# Altium schematic sheet Power_Management.SchDoc
size A3; SheetNumber: 2; SheetTotal: 5
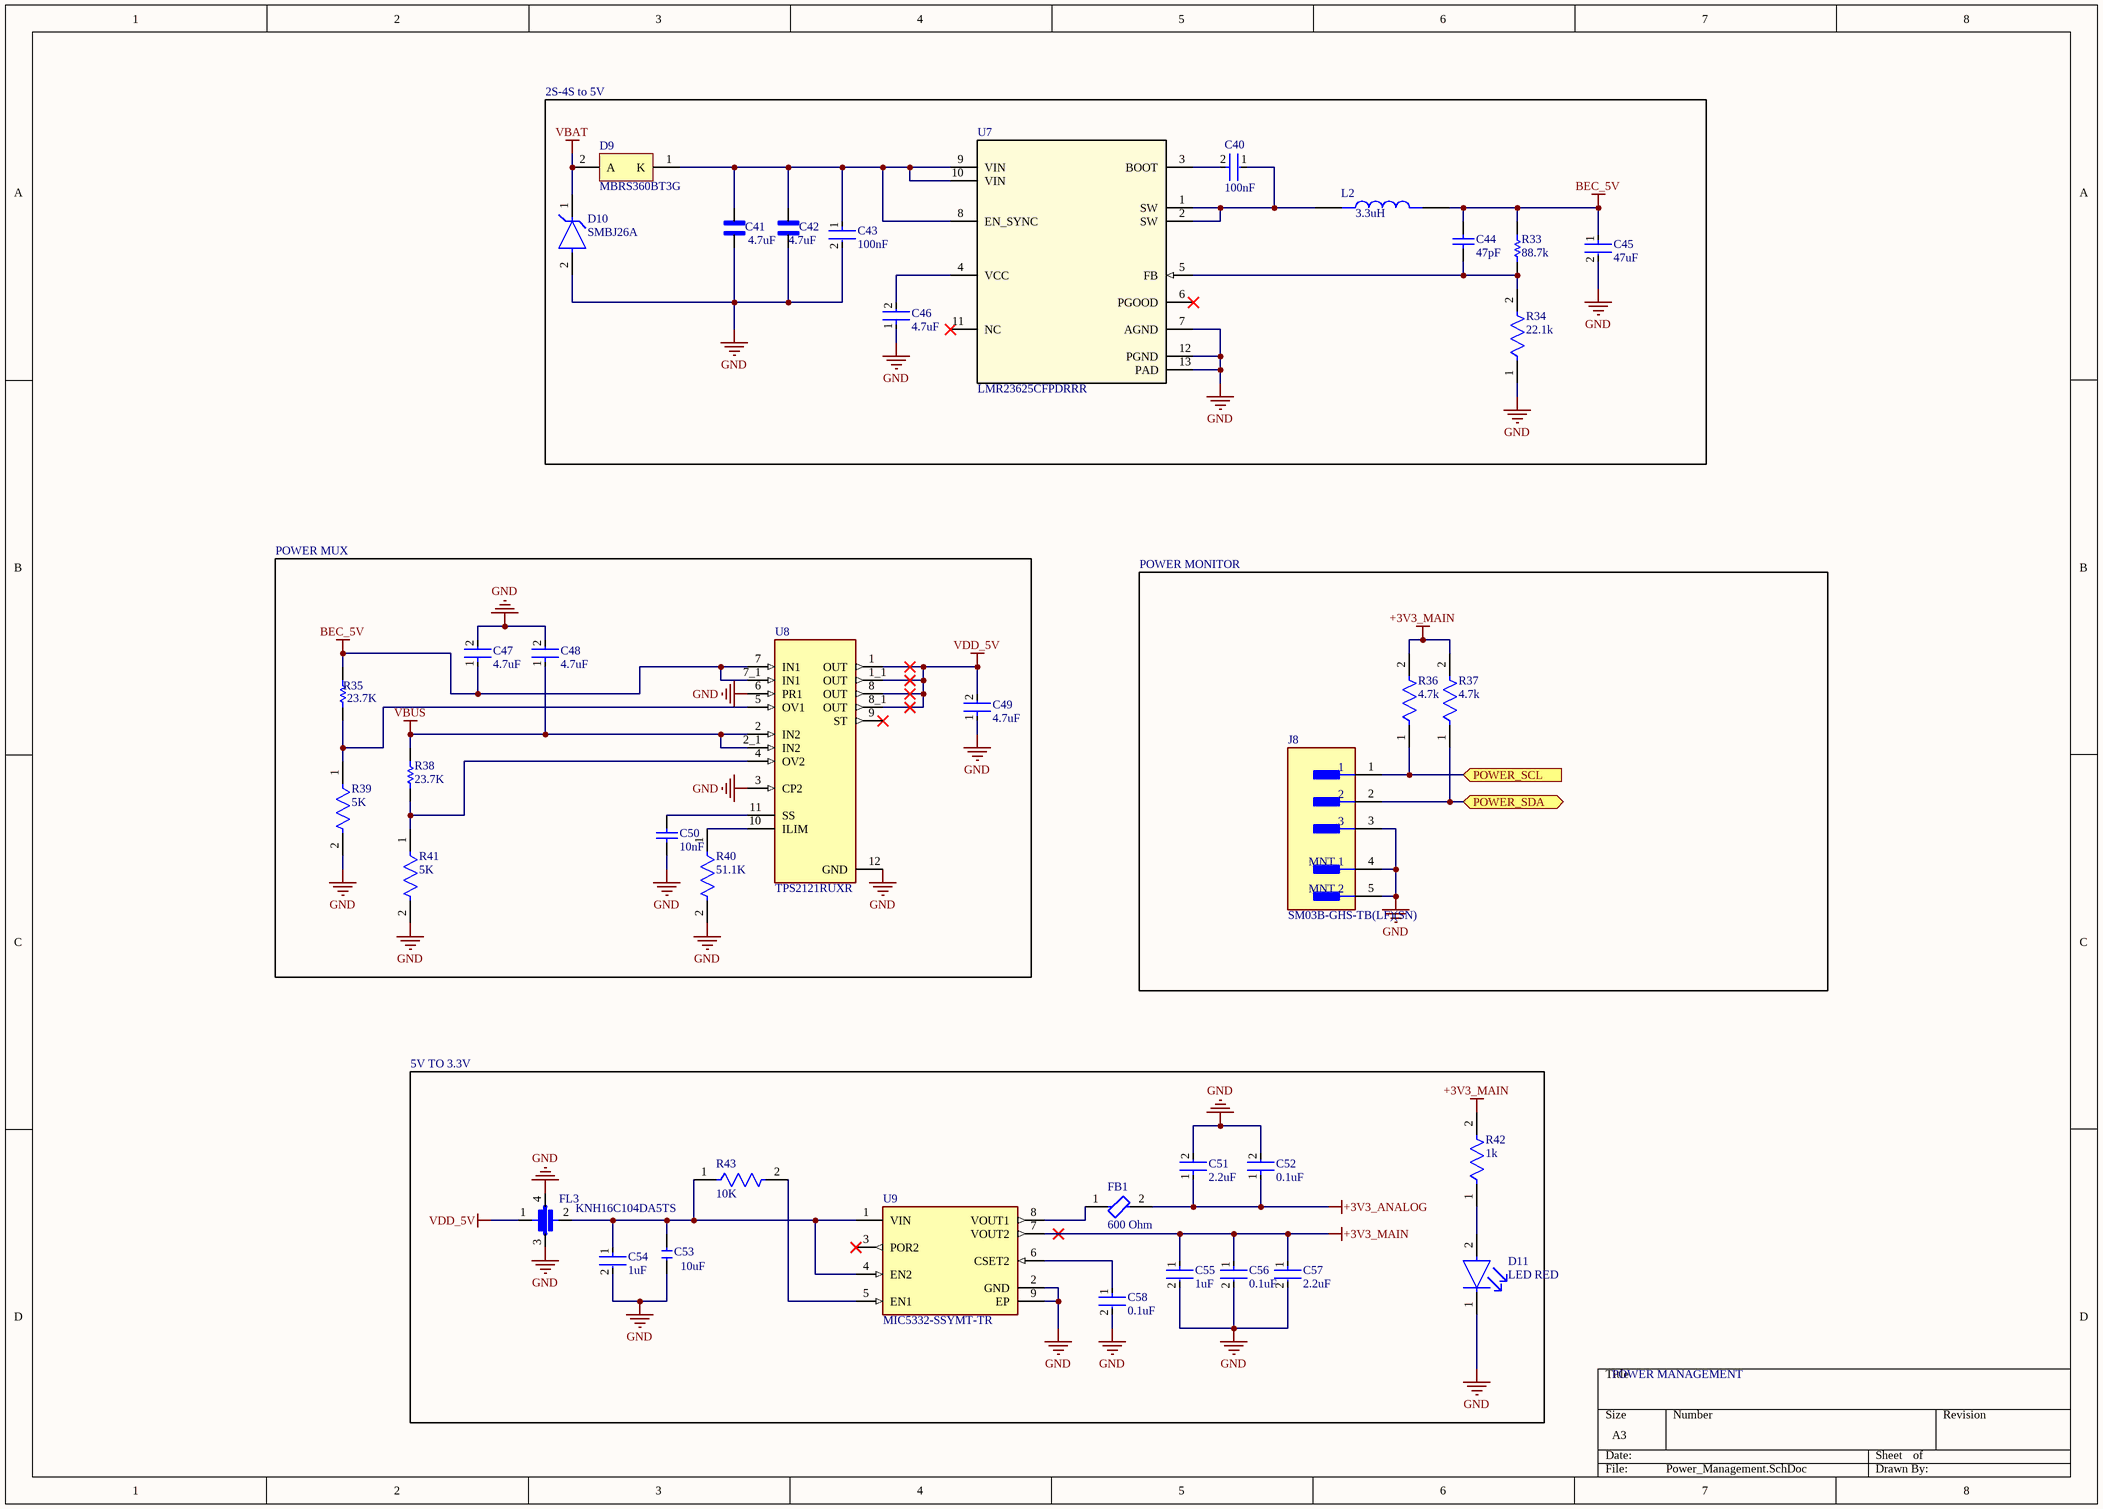
[diagram p0: Power_Management.SchDoc]

## Parts
C40  100nF  [FP-GRM15-MFG]
C41  MSASU32MSB7475MPNA01  [CAPC3225X270N]  (value not drawn)
C42  MSASU32MSB7475MPNA01  [CAPC3225X270N]  (value not drawn)
C43  100nF  [FP-CS0402-CA-MFG]
C44  47pF  [CAPC1005X55X25NL05T10]
C45  47uF  [FP-GRM31C-0_2-e0_3_0_8-IPC_A]
C46  4.7uF  [FP-GRT155-0_15-MFG]
C47  4.7uF  [FP-GRT155-0_15-MFG]
C48  4.7uF  [FP-GRT155-0_15-MFG]
C49  4.7uF  [FP-GRT155-0_15-MFG]
C50  10nF  [CAPC1005X60X30NL05T10]
C51  2.2uF  [FP-GRM155-0_2-IPC_B]
C52  0.1uF  [FP-C0402-BB-MFG]
C53  GRM155R60J106ME15D  [C0402]  (value not drawn)
C54  1uF  [FP-GRM155-0_1-IPC_A]
C55  1uF  [FP-GRM155-0_1-IPC_A]
C56  0.1uF  [FP-C0402-BB-MFG]
C57  2.2uF  [FP-GRM155-0_2-IPC_B]
C58  0.1uF  [FP-C0402-BB-MFG]
D9  MBRS360BT3G  [ONSC-SMB-2-403A-03_H_V]
D10  SMBJ26A  [FP-SMBJ-MFG]
D11  LED RED  [FP-SML-LXT0805IW-TR-MFG]
FB1  600 Ohm  [FP-BLM15-0_05-MFG]
FL3  KNH16C104DA5TS  [FIL_KNH16C104DA5TS]
J8  SM03B-GHS-TB(LF)(SN)  [FP-SM03B-GHS-TB_LF_SN-MFG]
L2  IND_XAL4030-332MEB  [IND_XAL4030-332MEB]  (value not drawn)
R33  88.7k  [RESC1005X40X25NL05T05]
R34  22.1k  [FP-CRCW0402-e3-IPC_A]
R35  23.7K  [RESC1005X40X25LL05T05]
R36  4.7k  [FP-TFCR0402-IPC_A]
R37  4.7k  [FP-TFCR0402-IPC_A]
R38  23.7K  [RESC1005X40X25LL05T05]
R39  5K  [FP-PNM0402-IPC_C]
R40  51.1K  [FP-RK73H1E-IPC_C]
R41  5K  [FP-PNM0402-IPC_C]
R42  1k  [FP-MCS0402-IPC_A]
R43  10K  [FP-MCS0402-MFG]
U7  LMR23625CFPDRRR  [DRR0012D]
U8  TPS2121RUXR  [IC_TPS2121RUXR]
U9  MIC5332-SSYMT-TR  [FP-MIC5332-SSYMT-TR-IPC_C]

## Blocks framed on the sheet
POWER MUX: C47-C50 R35 R38-R41 U8
POWER MONITOR: J8 R36 R37

## Ports
POWER_SCL (in, see EMP_FC_Main[2B], MCU_Core[1B]), POWER_SDA (bidir, see EMP_FC_Main[2C], MCU_Core[1B])

## Nets
+3V3_ANALOG: C51.1 C52.1 FB1.2
+3V3_MAIN: C55.1 C56.1 C57.1 R36.2 R37.2 R42.2 U9.7(VOUT2)
BEC_5V: C44.2 C45.1 C47.1 L2.2 R33.2 R35.2 U8.7(IN1) U8.7_1(IN1)
GND: C41.1 C42.1 C43.2 C45.2 C46.1 C47.2 C48.2 C49.1 C50.1 C51.2 C52.2 C53.1 C54.2 C55.2 C56.2 C57.2 C58.2 D10.2(A) D11.1(C) FL3.3 FL3.4 J8.3 J8.4(MNT_1) J8.5(MNT_2) R34.1 R39.2 R40.2 R41.2 U7.7(AGND) U7.12(PGND) U7.13(PAD) U8.3(CP2) U8.6(PR1) U8.12(GND) U9.2(GND) U9.9(EP)
VBAT: D9.2(A) D10.1(C)
VBUS: C48.1 R38.2 U8.2(IN2) U8.2_1(IN2)
VDD_5V: C49.2 FL3.1 U8.1(OUT) U8.1_1(OUT) U8.8(OUT) U8.8_1(OUT)
POWER_SCL: J8.1 R36.1 ; port POWER_SCL
POWER_SDA: J8.2 R37.1 ; port POWER_SDA
NetC40_1: C40.1 L2.1 U7.1(SW) U7.2(SW)
NetC40_2: C40.2 U7.3(BOOT)
NetC41_2: C41.2 C42.2 C43.1 D9.1(K) U7.8(EN_SYNC) U7.9(VIN) U7.10(VIN)
NetC44_1: C44.1 R33.1 R34.2 U7.5(FB)
NetC46_2: C46.2 U7.4(VCC)
NetC50_2: C50.2 U8.11(SS)
NetC53_2: C53.2 C54.1 FL3.2 R43.1 U9.1(VIN) U9.4(EN2)
NetC58_1: C58.1 U9.6(CSET2)
NetD11_2: D11.2(A) R42.1
NetFB1_1: FB1.1 U9.8(VOUT1)
NetR35_1: R35.1 R39.1 U8.5(OV1)
NetR38_1: R38.1 R41.1 U8.4(OV2)
NetR40_1: R40.1 U8.10(ILIM)
NetR43_2: R43.2 U9.5(EN1)

Not connected (* = marked no-connect by the designer): U7 6(PGOOD)* 11(NC)*; U8 9(ST)*; U9 3(POR2)*

## Notes on the sheet
- 2S-4S to 5V
- 4.7uF
- (near C42) 4.7uF
- (near L2) 3.3uH
- 5V TO 3.3V
- (near C53) 10uF
- POWER MANAGEMENT

## Library data of the parts
C40 = CMP-2100-03641-2: CAP CER 0.1UF 16V X7R 0402; Manufacturer Part Number: GRM155R71C104KA88D; Manufacturer: Murata; Standoff Height: 0mm; Tolerance: 10%; Voltage Rating: 16Vdc; Material: Ceramic; Capacitance: 0.10μF; Value: 0.10μF; RoHS: TRUE; Temperature Characteristic: X7R; Octopart: https://octopart.com/grm155r71c104ka88d-murata-196880; Digikey Description: CAP CER 0.1UF 16V X7R 0402; Device Class L3: Ceramic Capacitors; Height: 0.55mm; ComponentLink2Description: Datasheet; Temperature Range Low: -55°C; Ipc Land Pattern Name: CAPC10050X219; ComponentLink2URL: https://search.murata.co.jp/Ceramy/image/img/A01X/G101/ENG/GRM155R71H471KA01-01A.pdf; Device Class L1: Passive Components; Lead Free: yes; Category: Cap; Package: GRM15; Temperature: -55°C to +125°C; Device Class L2: Capacitors; Temperature Range High: +125°C; Mouser Description: 0402 0.1 uF 16V ±10 % Tolerance X7R SMT Multilayer Ceramic Capacitor
C41 C42 = MSASU32MSB7475MPNA01: MF: {'manufacturer': u'Taiyo Yuden'}; Package: None; Price: None; Value: *; MP: MSASU32MSB7475MPNA01; Availability: Unavailable
C43 = CMP-00621-74602085-1: CS0402KRX7R8BB104 Multilayer Ceramic Capacitor, 0.1 uF, 25 V, ± 10%, X7R, 0402 [1005 Metric]; Voltage Rating: 25V; Capacitance: 100nF; Material: Ceramic; Thickness: 660.4µm; Features: Soft Termination; Max Operating Temperature: 125°C; Mount: Surface Mount; Min Operating Temperature: -55°C; Length: 990.6µm; Height: 650µm; Width: 508µm; Tolerance: 10%; Case/Package: 0402; NexarPartId: 74602085; RoHS: Compliant
C44 = CMP-2008-04203-1: Part Number: GRM1555C1E470JA01D; Manufacturer: Murata
C45 = CMP-06035-007919-1: Chip Multilayer Ceramic Capacitors for General Purpose, 1206, 47uF, X5R, 15%, 10%, 10V; Width: 0.063inch; Thickness: 0.071inch; Max Operating Temperature: 85°C; Min Operating Temperature: -55°C; Length: 3.2mm; Case Code (Metric): 3216; Resistor Type: Ceramic; Packaging: Tape and Reel; Weight: 0.001411oz; Case Code (Imperial): 1206; Mount: Surface Mount; Depth: 1.6mm; Capacitance: 47uF; Package Quantity: 6000; Height: 1.6mm; Case/Package: 1206; Tolerance: 10%; Dielectric: X5R; Voltage Rating: 10V; Voltage Rating (DC): 10V; Termination: SMD/SMT
C46-C49 = CMP-06035-058540-1: Multi-Layer Ceramic Capacitor 4.7uF 10V X5R ±20% 0402 Paper T/R
C50 = CMP-2008-02101-1: Part Number: C0402C103K3RALTU; Manufacturer: Kemet
C51 C57 = CMP-06035-053544-1: Chip Multilayer Ceramic Capacitors for General Purpose, 0402, 2.2uF, X7R, 15%, 10%, 10V
C52 C56 C58 = CMP-03020-002733-1: CAP CER 0.1UF 10V X7R 0402; Manufacturer: Kemet; Manufacturer Part Number: C0402C104K8RACAUTO; Material: Ceramic; Value: 0.10 μF; Tolerance: 0.1; Temperature Coefficient: 15%; ComponentLink2Description: Datasheet; Automotive: No; Digikey Description: CAP CER 0.1UF 10V X7R 0402; Temperature Range Low: -55°C; Ipc Land Pattern Name: CAPC10050X50; Lead Free: Yes; Category: Cap; Package: C0402-BB; Octopart: https://octopart.com/c0402c104k8racauto-kemet-9145167; Voltage Rating: 10 V; Device Class L2: Capacitors; Capacitance: 0.10 μF; Temperature Range High: +125°C; Height: 0.55mm; ComponentLink2URL: https://content.kemet.com/datasheets/KEM_C1002_X7R_SMD.pdf; Temperature: -55°C to +125°C; Device Class L1: Passive Components; Temperature Characteristic: X7R; RoHS: TRUE; Device Class L3: Ceramic Capacitors
C53 = CERAMIC-10UF-6.3V-20%-X5R(0402): 10 ÂµF Â±20% 6.3V Ceramic Capacitor X5R 0402 (1005 Metric); Value: 10uF; MF: Yageo; MP: CC0402MRX5R5BB106; SnapEDA_Link: https://www.snapeda.com/parts/CC0402MRX5R5BB106/Yageo/view-part/?ref=snap; Package: 0402 Yageo; Check_prices: https://www.snapeda.com/parts/CC0402MRX5R5BB106/Yageo/view-part/?ref=eda
C54 C55 = CMP-06035-012596-1: Chip Multilayer Ceramic Capacitors for General Purpose, 0402, 1.0uF, X7R, 15%, 10%, 10V
D9 = CMP-1055-00339-1: Schottky Power Rectifier, 2-Pin SMB, Pb-Free, Tape and Reel; Manufacturer: On Semiconductor; Configuration: Single; IFSM Max (A): 125; ComponentLink3Description: Package Specification; ComponentLink2Description: Datasheet; DatasheetVersion: Rev. 8; ComponentLink2URL: http://www.onsemi.cn/pub_link/Collateral/MBRS360T3-D.PDF; ComponentLink3URL: http://www.onsemi.com/pub_link/Collateral/1SMB5913BT3-D.PDF; PackageReference: SMB-2-403A-03_H; PackageVersion: Rev. H, 05/2011; ComponentLink1URL: http://www.onsemi.com/; Packing: Tape and Reel; RoHS: TRUE; PartNumber: MBRS360BT3G; PackageDescription: 2-Pin Small Molded Package, J-Bend Lead, Body 4.33 x 3.625 mm; Mounting Technology: Surface Mount; ComponentLink1Description: Manufacturer URL
D10 = CMP-08607-000063-1: TVS DIODE 26V 42.1V DO214AA; Manufacturer: Littelfuse; Breakdown Voltage: 28.9V; Peak Pulse Power: 600W; Peak Pulse Current: 14.3A; Direction: Unidirectional; Number Of Channels: 1; Max Junction Temp: +150°C; Lead Free: Yes; Device Class L1: Circuit Protection; Height: 2.61mm; Device Class L3: unset; Reverse Standoff Voltage: 26V; ComponentLink2URL: https://www.littelfuse.com/~/media/electronics/datasheets/tvs_diodes/littelfuse_tvs_diode_smbj_datasheet.pdf.pdf; Automotive: No; Octopart: https://octopart.com/smbj26a-littelfuse-350771; Device Class L2: TVS Diodes; Clamping Voltage: 42.1V; Manufacturer Part Number: SMBJ26A; Temperature Range High: +150°C; Category: Diode; RoHS: TRUE; Temperature: -65°C to +150°C; Mouser Description: TVS Diodes - Transient Voltage Suppressors 26Vr 600W 14.3A 5% UniDirectional; Package: SMBJ; Digikey Description: TVS DIODE 26V 42.1V DO214AA; Temperature Range Low: -65°C; ComponentLink2Description: Datasheet
D11 = CMP-1724-00002-2: LED RED DIFFUSED SMD; Lens Style: Rectangular; Luminous Intensity: 11mcd; Approvals: UL; Test Current: 20mA; Forward Voltage: 2V; Number of LEDs: 1; Wavelength: 635nm; Lens Color: White; Viewing Angle: 140°; Min Operating Temperature: -25°C; Case Code (Metric): 2012; Mount: Surface Mount; Case Code (Imperial): 0805; Height: 0.8mm; Lead Free: Lead Free; Color: Red; Package Quantity: 1; Illumination Color: Red; Lens Transparency: Diffused; Forward Current: 20mA; Packaging: Tape and Reel; Length: 2mm; Case/Package: 0805; REACH SVHC: No SVHC; Width: 1.25mm; Number of Pins: 2; Max Operating Temperature: 80°C; Dominant Wavelength: 635nm
FB1 = CMP-00260-117051428-1: BLM15PE601SH1D Ferrite Bead, 600 Ohm, 25%, 0402 Rohs Compliant: Yes; Test Frequency: 100MHz; Resistance: 400mΩ; RMS Current (Irms): 700mA; Tolerance: 25%; Height: 550µm; Lifecycle Status: Production; NexarPartId: 117051428; Case/Package: 0402; Min Operating Temperature: -55°C; Series Resistance: 400mΩ; Max Operating Temperature: 125°C; Core Material: Ferrite
FL3 = KNH16C104DA5TS: MF: {'manufacturer': u'KYOCERA AVX'}; Package: None; Price: None; Value: *; MP: KNH16C104DA5TS; Availability: Unavailable
J8 = CMP-17439-000068-1: CONN HEADER SMD R/A 3POS 1.25MM; Voltage Rating: 50V; Wire/Cable Gauge: 26AWG; Pitch: 0.049inch; Gender: Male; Number of Positions: 3; Current Rating: 1A; Orientation: Right Angle; REACH SVHC: No SVHC; Insulation Color: Natural; Housing Material: Nylon; Mount: Surface Mount; Flammability Rating: UL94 V-0; Color: Natural; Number of Rows: 1; Housing Color: Natural; Termination: Solder; Voltage Rating (AC): 50V; Max Operating Temperature: 85°C; Connector Type: Header; Series: GH; Packaging: Tape and Reel; Contact Finish - Mating: TIN; Lead Free: Lead Free; Fastening Type: Ramp; Contact Plating: Tin; Contact Material: Bronze; Insulation Material: Nylon; Contact Type: Outer Shroud Contact; Number of Contacts: 3; Min Operating Temperature: -25°C; Contact Shape: Rectangular
L2 = XAL4030-332MEB: Package: None; Price: None; Value: *; MP: XAL4030-332MEB; Availability: Unavailable
R33 = CMP-2002-00251-1: Manufacturer: Vishay Dale; Part Number: CRCW040288K7FKED
R34 = CMP-2002-08380-2: RES Thick Film, 22.1kΩ, 1%, 0.063W, 100ppm/°C, 0402; Voltage Rating: 50V; Resistance: 22.1kR; Power Rating: 63mW; Length: 1mm; Termination: SMD/SMT; Height: 0.35mm; Package Quantity: 10000; Depth: 0.5mm; Lead Free: Lead Free; Packaging: Tape and Reel; Case/Package: 0402; Max Operating Temperature: 155°C; Composition: Thick Film; Min Operating Temperature: -55°C; Working Voltage: 50V; Number of Pins: 2; Contact Plating: Tin; Mount: Surface Mount; Case Code (Imperial): 0402; Temperature Coefficient: 100ppm/°C; Tolerance: 1%; Voltage Rating (DC): 50V; Width: 0.5mm; Number of Terminations: 2; Radiation Hardening: No; Weight: 2.3E-05oz; Military Standard: Not; Case Code (Metric): 1005
R35 R38 = CMP-2002-00388-1: Manufacturer: Vishay Dale; Part Number: CRCW040223K7FKTD
R36 R37 = CMP-250906-194630-1: RES Thin Film,  4.7kΩ, 0.5%, 0.063W, 25ppm/°C, 0402
R39 R41 = CMP-02407-012302-1: RES SMD 5K OHM 0.1% 1/20W 0402; Temperature Coefficient: 25ppm/°C; Resistance: 5kR; Max Power Dissipation: 50mW; Width: 0.022inch; Height: 0.033inch; Tolerance: 0.1%; Number of Terminations: 2; Packaging: Tape and Reel; RoHS Compliant: Yes; Case Code (Imperial): 0402; Min Operating Temperature: -55°C; Case Code (Metric): 1005; Features: Moisture Resistant; Max Operating Temperature: 155°C; Package Quantity: 1000; Resistor Type: Thin Film; Length: 0.042inch; Case/Package: 0402
R40 = CMP-04015-106274-1: 51.1kΩ ±1% 0.1W Chip Resistor 0402 Thick Film AEC-Q200 Qualified; Voltage Rating: 50V; Resistance: 51.1kR; Temperature Coefficient: 100ppm/°C; Power Rating: 63mW; Series: RK73H; Min Operating Temperature: -55°C; Construction: Rectangular; Length: 1mm; Case Code (Imperial): 0402; Case Code (Metric): 1005; Voltage Rating (DC): 50V; Tolerance: 1%; Lead Free: Contains Lead; Width: 0.5mm; Height: 0.35mm; Military Standard: Not; Packaging: Tape and Reel; Package Quantity: 10000; Case/Package: 0402; Max Operating Temperature: 155°C; Termination: SMD/SMT; Resistor Type: Thick Film; RoHS Compliant: No; Depth: 0.5mm
R42 = CMP-02407-001712-1: RES SMD 1.2K OHM 1% 1/10W 0402; Tolerance: 0.5%; Temperature Coefficient: 25ppm/°C; Max Power Dissipation: 200mW; Resistance: 1kR; Case Code (Metric): 1005; Min Operating Temperature: -55°C; Max Operating Temperature: 175°C; Features: Automotive AEC-Q200; Composition: Thin Film; Case Code (Imperial): 0402; Number of Terminations: 2; Case/Package: 0402; Packaging: Cut Tape
R43 = CMP-02407-000363-1: RES SMD 1.2K OHM 1% 1/10W 0402; Power Rating: 100mW; Temperature Coefficient: 25ppm/°C; Tolerance: 0.5%; Voltage Rating: 50V; Resistance: 10kR; Value: 10kR; Package Quantity: 10000; Case Code (Metric): 1005; Height: 0.015inch; Termination: SMD/SMT; Features: Automotive AEC-Q200; Packaging: Tape and Reel; Length: 0.039inch; Min Operating Temperature: -55°C; Case/Package: 0402; Max Power Dissipation: 100mW; Case Code (Imperial): 0402; Width: 0.5mm; Contact Plating: Tin; Weight: 2.1E-05oz; Max Operating Temperature: 175°C; Composition: Thin Film; Number of Terminations: 2; Radiation Hardening: No
U7 = LMR23625CFPDRRR: SIMPLE SWITCHERÂ®, 36V 2.5A Synchronous Step-Down Converter 12-WSON -40 to 125; Manufacturer_Name: Texas Instruments; TYPE: TYPE; RefDes: RefDes; Copyright: Copyright (C) 2025 Ultra Librarian. All rights reserved.; Manufacturer_Part_Number: LMR23625CFPDRRR; Datasheet: https://www.ti.com/lit/gpn/lmr23625
U8 = TPS2121RUXR: 2.7-V&nbsp;to 22-V, 56-mâ„¦, 4.5-A, power mux with seamless switchover; MF: Texas Instruments; Package: VQFN-HR-12 Texas Instruments; Price: None; Check_prices: https://www.snapeda.com/parts/TPS2121RUXR/Texas+Instruments/view-part/?ref=eda; Value: *; SnapEDA_Link: https://www.snapeda.com/parts/TPS2121RUXR/Texas+Instruments/view-part/?ref=snap; MP: TPS2121RUXR; Availability: In Stock; Purchase-URL: https://pricing.snapeda.com/search?q=TPS2121RUXR&ref=eda
U9 = CMP-06324-000082-1: IC REG LINEAR 3.3V/3.3V 8TMLF; Dropout Voltage: 120mV; Output Current: 300mA; Number of Outputs: 2; Output Voltage: 3.3V; Min Current Limit: 350mA; Min Input Voltage: 2.3V; Polarity: Positive; Output Voltage Accuracy: 1%; Packaging: Tape and Reel; Min Operating Temperature: -40°C; Series: -; Mount: Surface Mount; Max Operating Temperature: 125°C; Package Quantity: 1; RoHS Compliant: Yes; Number of Regulators: 2; Number of Pins: 8